# EAGLE design node_prototype (EAGLE 7.5.0)
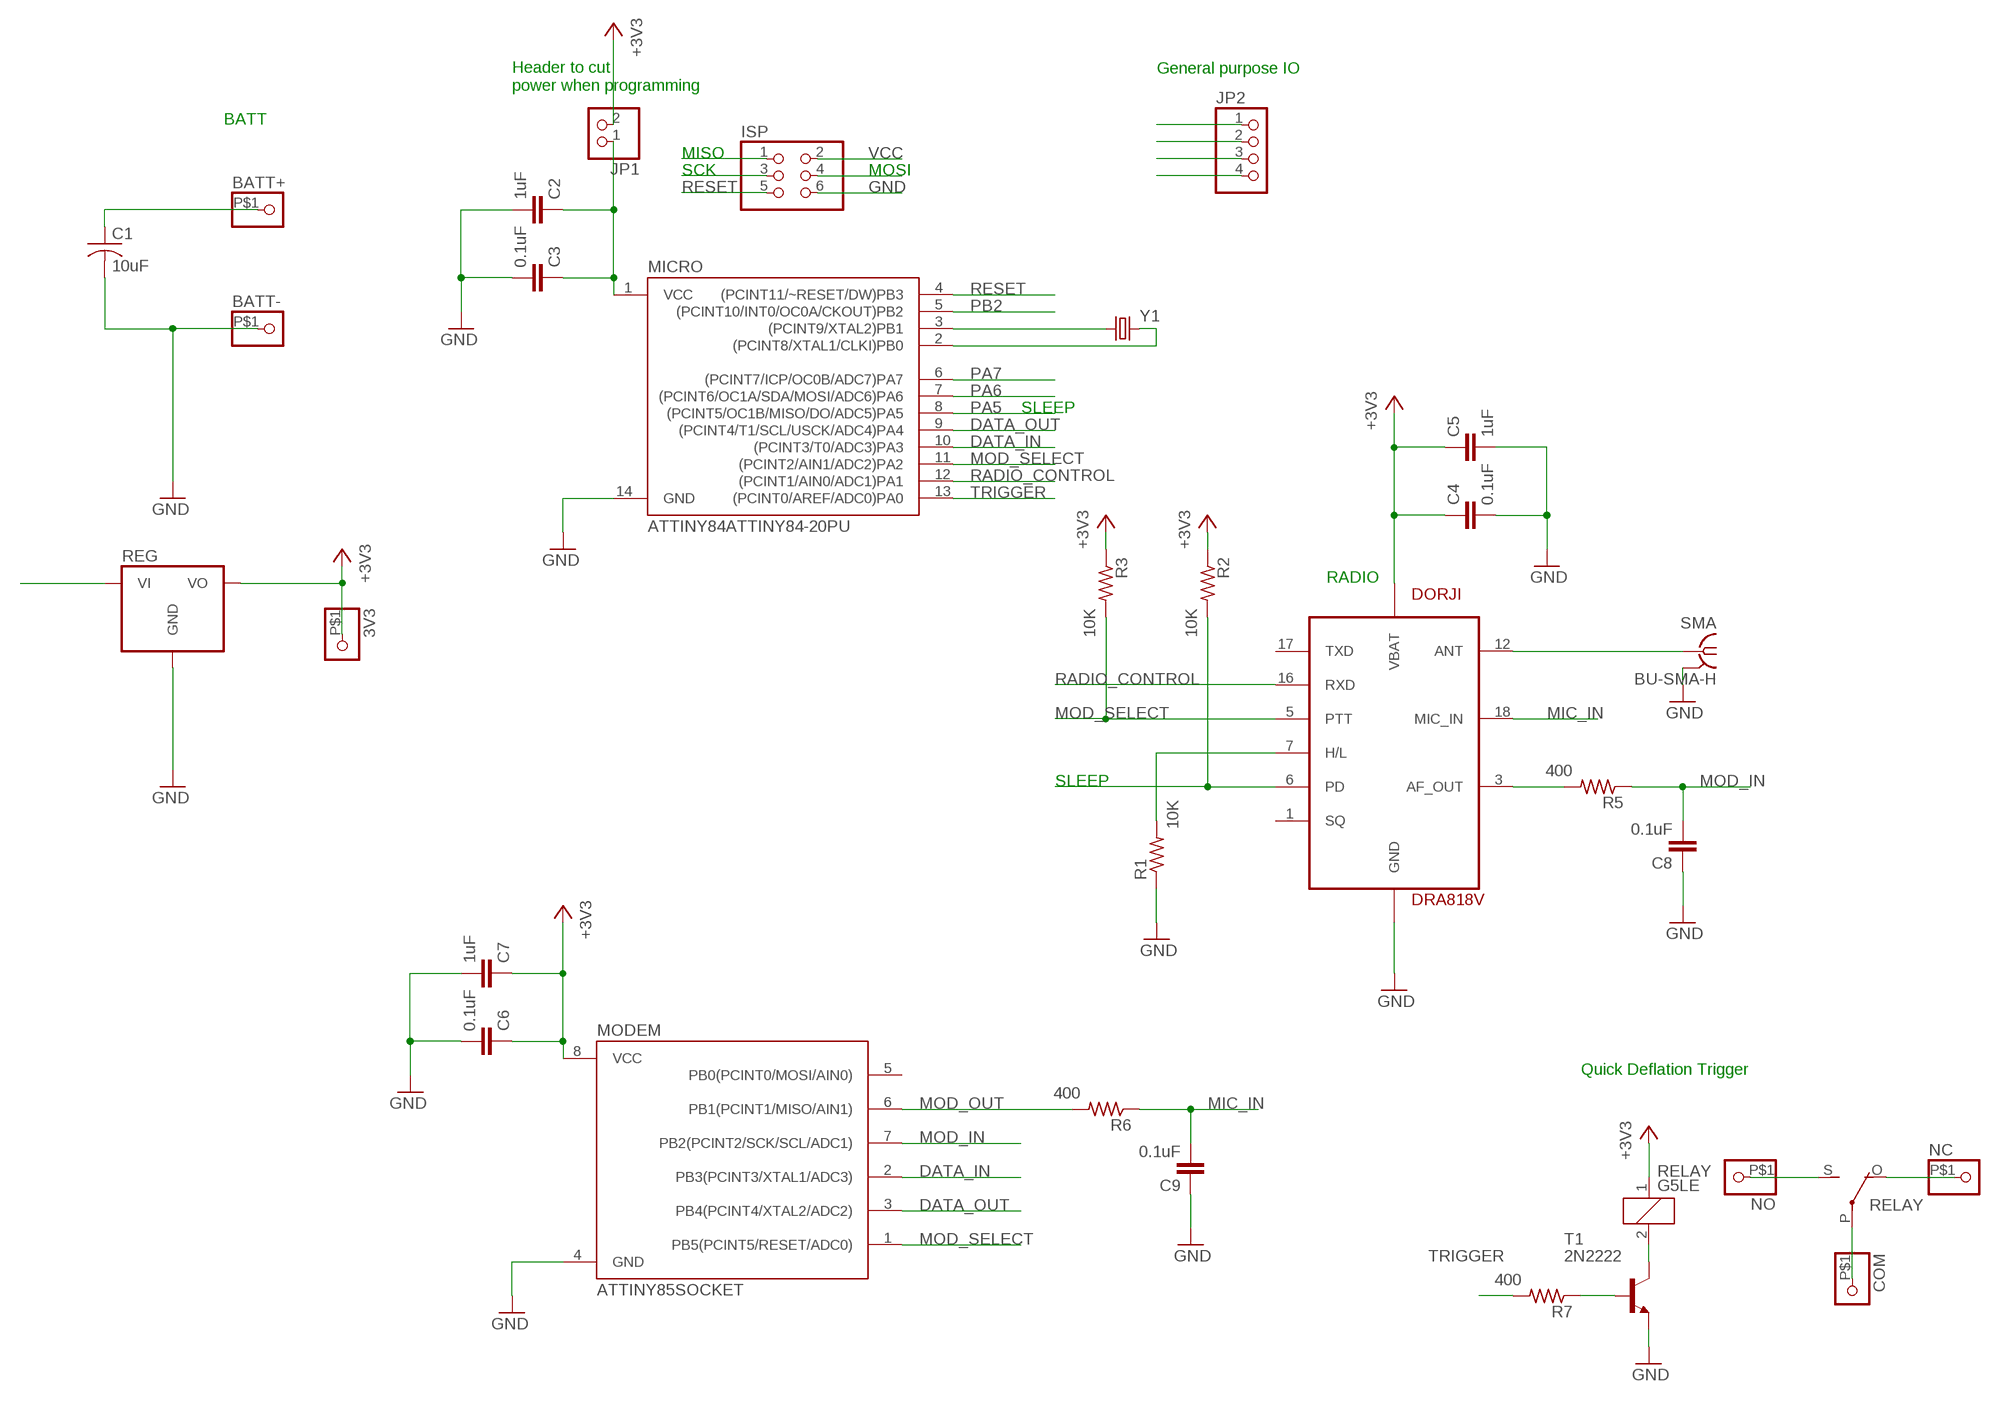
[diagram p0: schematic, sheet 1]

## Parts
3V3  PINHD-1X1  [1X01]
BATT+  PINHD-1X1  [1X01]
BATT-  PINHD-1X1  [1X01]
C1  10uF  C-US025-050X050  [C025-050X050]
C2  1uF  C-EUC0603  [C0603]
C3  0.1uF  C-EUC0603  [C0603]
C4  0.1uF  C-EUC0603  [C0603]
C5  1uF  C-EUC0603  [C0603]
C6  0.1uF  C-EUC0603  [C0603]
C7  1uF  C-EUC0603  [C0603]
C8  0.1uF  C-EUC0603  [C0603]
C9  0.1uF  C-EUC0603  [C0603]
COM  PINHD-1X1  [1X01]
DORJI  DRA818V  DORJIDRA818V  [DORJI]
ISP  PINHD-2X3  [2X03]
JP1  PINHD-1X2  [1X02]
JP2  PINHD-1X4  [1X04]
MICRO  ATTINY84ATTINY84-20PU  [DIL14]
MODEM  ATTINY85SOCKET  [SOCKET-08]
NC  PINHD-1X1  [1X01]
NO  PINHD-1X1  [1X01]
R1  10K  R-US_R0603  [R0603]
R2  10K  R-US_R0603  [R0603]
R3  10K  R-US_R0603  [R0603]
R5  400  R-US_R0603  [R0603]
R6  400  R-US_R0603  [R0603]
R7  400  R-US_R0603  [R0603]
REG  AP1117-3.3SOT223  [SOT223]
RELAY  G5LE  [G5LE]
SMA  BU-SMA-H  [BU-SMA-H]
T1  2N2222  [TO18]
Y1  CRYSTAL  [MYSMD2_RESONATOR]

## Nets
+3V3: 3V3.P$1 C4.1 C5.1 C6.1 C7.1 DORJI.8(VBAT) JP1.2 MODEM.8(VCC) R2.1 R3.1 REG.2(VO) REG.4(VO) RELAY.1
BATT: BATT+.P$1 C1.1 REG.3(VI)
DATA_IN: MICRO.10((PCINT3/T0/ADC3)PA3) MODEM.2(PB3(PCINT3/XTAL1/ADC3))
DATA_OUT: ISP.3 MICRO.9((PCINT4/T1/SCL/USCK/ADC4)PA4) MODEM.3(PB4(PCINT4/XTAL2/ADC2))
GND: BATT-.P$1 C1.2 C2.2 C3.2 C4.2 C5.2 C6.2 C7.2 C8.1 C9.1 DORJI.9(GND) DORJI.10(GND) ISP.6 MICRO.14(GND) MODEM.4(GND) R1.1 REG.1(GND) SMA.2 SMA.3 SMA.4 SMA.5 T1.1(E)
MIC_IN: C9.2 DORJI.18(MIC_IN) R6.1
MOD_IN: C8.2 MODEM.7(PB2(PCINT2/SCK/SCL/ADC1)) R5.1
MOD_OUT: MODEM.6(PB1(PCINT1/MISO/AIN1)) R6.2
MOD_SELECT: DORJI.5(PTT) MICRO.11((PCINT2/AIN1/ADC2)PA2) MODEM.1(PB5(PCINT5/RESET/ADC0)) R3.2
N$1: DORJI.12(ANT) SMA.1
N$2: DORJI.7(H/L) R1.2
N$4: DORJI.3(AF_OUT) R5.2
N$6: R7.1 T1.2(B)
N$7: RELAY.2 T1.3(C)
N$8: MICRO.3((PCINT9/XTAL2)PB1) Y1.1
N$9: NO.P$1 RELAY.S(2:S)
N$10: NC.P$1 RELAY.O(2:O)
N$11: COM.P$1 RELAY.P(2:P)
N$12: MICRO.2((PCINT8/XTAL1/CLKI)PB0) Y1.3
PA5: DORJI.6(PD) ISP.1 JP2.4 MICRO.8((PCINT5/OC1B/MISO/DO/ADC5)PA5) R2.2
PA6: ISP.4 JP2.3 MICRO.7((PCINT6/OC1A/SDA/MOSI/ADC6)PA6)
PA7: JP2.2 MICRO.6((PCINT7/ICP/OC0B/ADC7)PA7)
PB2: JP2.1 MICRO.5((PCINT10/INT0/OC0A/CKOUT)PB2)
RADIO_CONTROL: DORJI.16(RXD) MICRO.12((PCINT1/AIN0/ADC1)PA1)
RESET: ISP.5 MICRO.4((PCINT11/~RESET/DW)PB3)
TRIGGER: MICRO.13((PCINT0/AREF/ADC0)PA0) R7.2
VCC: C2.1 C3.1 ISP.2 JP1.1 MICRO.1(VCC)
Unconnected: DORJI.1(SQ) DORJI.17(TXD) MODEM.5(PB0(PCINT0/MOSI/AIN0))

## Notes on the sheet
- General purpose IO
- Header to cut
  power when programming
- BATT
- MISO
- SCK | MOSI
- SLEEP
- RADIO
- SLEEP
- Quick Deflation Trigger

## Library data of the parts
3V3 BATT+ BATT- COM NC NO = evan:PINHD-1X1: PIN HEADER
C1 = rcl:C-US: CAPACITOR, American symbol
C2-C9 = rcl:C-EU: CAPACITOR, European symbol
DORJI = dorji:DORJI: DRA818V 2-Meter transceiver modul
ISP = pinhead:PINHD-2X3: PIN HEADER
JP1 = pinhead:PINHD-1X2: PIN HEADER
JP2 = pinhead:PINHD-1X4: PIN HEADER
MICRO = evan:ATTINY84: Atmel 14-pin 2/4/8kB flash uC
MODEM = evan:ATTINY85: Atmel 14-pin 2/4/8kB flash uC
R1-R3 R5-R7 = rcl:R-US_: RESISTOR, American symbol
REG = evan:AP1117-3.3: http://www.digikey.com/product-detail/en/AP1117IE33G-13/AP1117IE33G-13DICT-ND/3677984 800mA and 1A Low Dropout (LDO) Positive Regulator 1.8V, 2.5V, 2.85V, 3.3V, 5V, and Adj
RELAY = relay:G5LE: RELAY 1 x switch, 10 A/120 V AC, 8 A/30 V DC, Omron; OC_FARNELL: unknown; OC_NEWARK: unknown
SMA = con-coax:BU-SMA-H: FEMALE SMA CONNECTOR Radiall; OC_FARNELL: unknown; OC_NEWARK: unknown
T1 = transistor:2N2222: NPN TRANSISTOR
Y1 = evan:CRYSTAL: CSTCE16M0V53-R0 Crystal

## Board
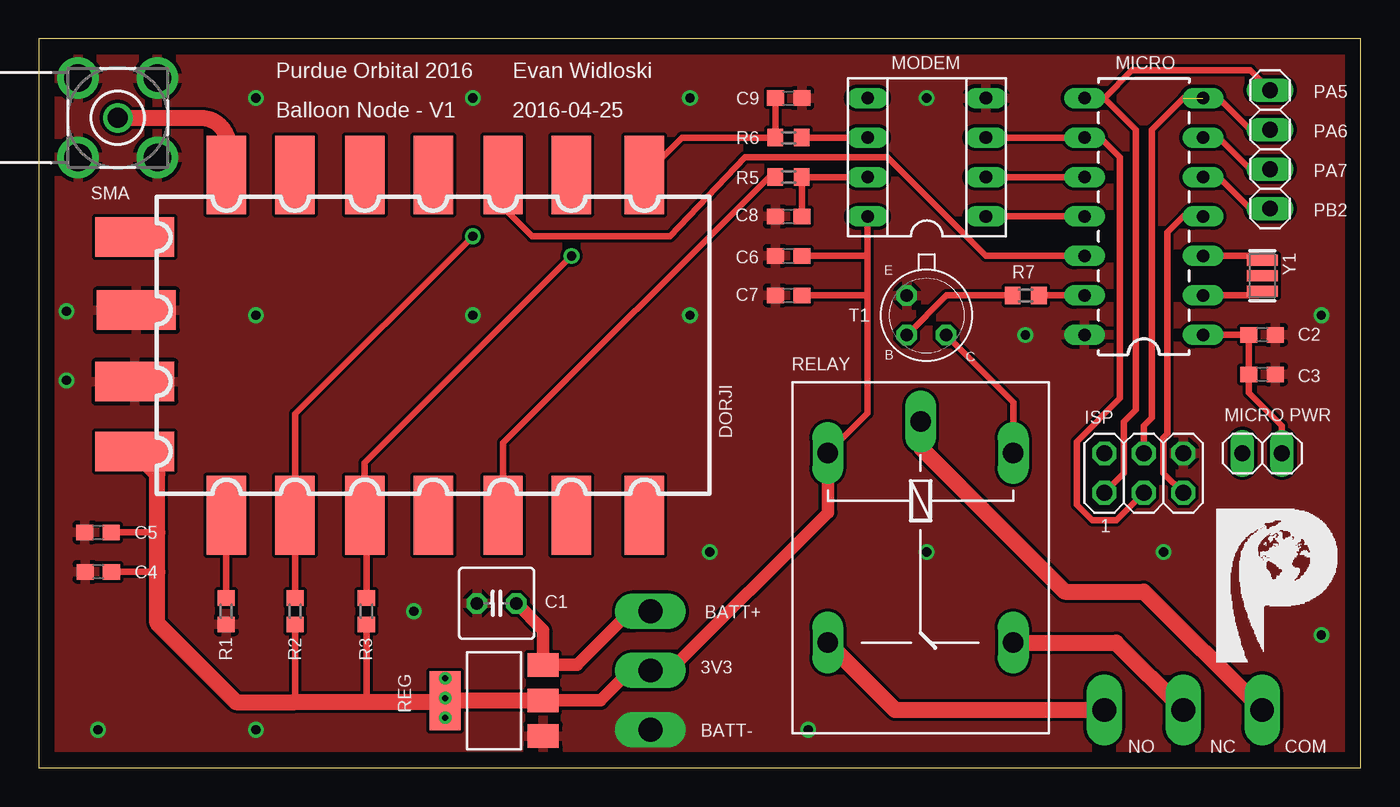
[diagram p1: board, top side]
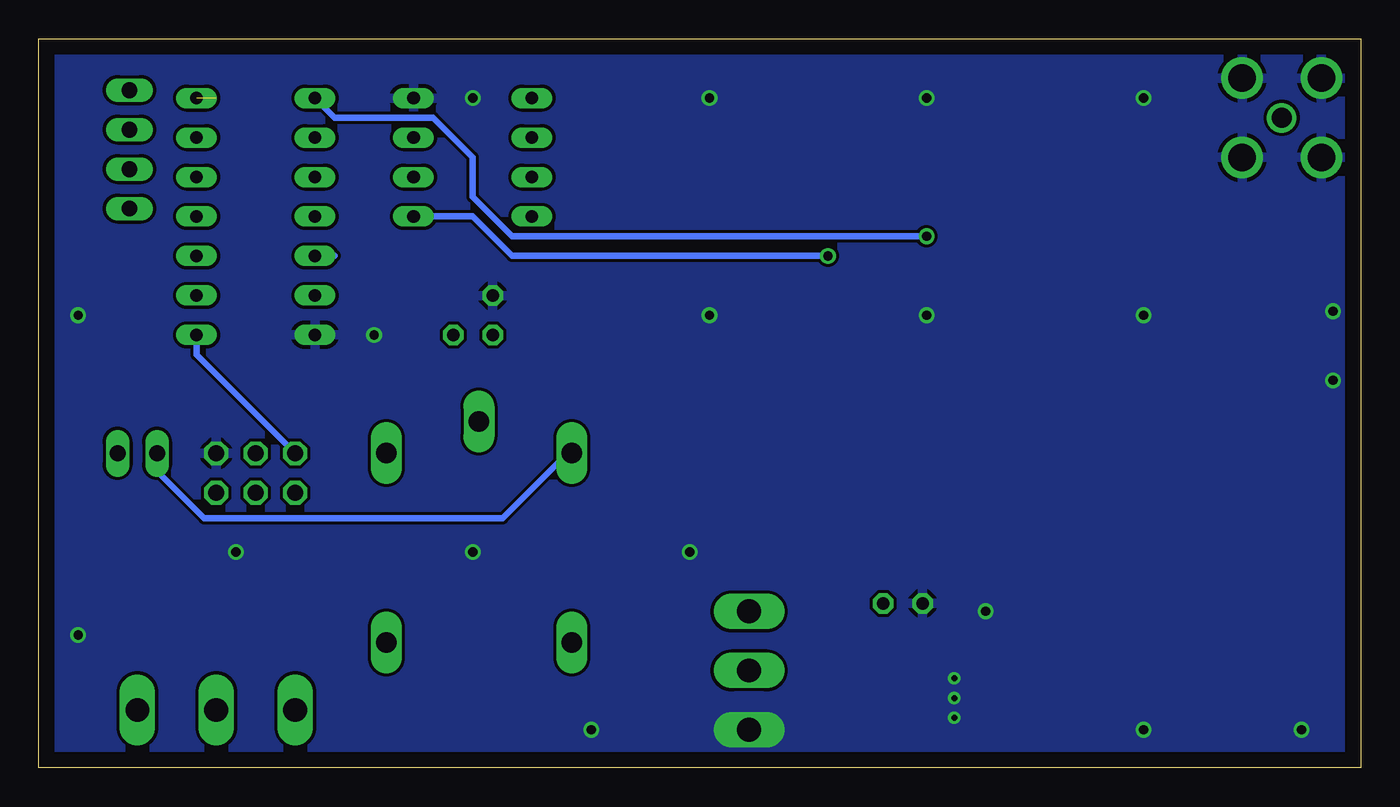
[diagram p2: board, bottom side, seen from below]

Size 85.08 x 46.91 mm. Coordinates in mm from the lower left corner, seen from the top.
Outline: 0,46.91 0,0 85.08,0 85.08,46.91 0,46.91
Copper layers (1*16): Top 0.035mm / dielectric 1.5mm / Bottom 0.035mm
Design rules "default": minimum track width 10mil, minimum drill 24mil, track to track 8mil, track to pad 8mil, pad to pad 8mil, via to via 8mil, smd to smd 8mil, copper to edge 40mil, drill to drill 8mil, minimum pad ring 10mil, minimum via ring 8mil, stop-mask expansion 4mil, vias tented up to drill 0mil, thermal gap 10mil

### Footprints (pad centres in the part's own frame; a part is rotated, then mirrored left to right if it is on the bottom)
1X01 = drill 1.524 pad 1.676 long: P$1 0,0
C025-050X050 = drill 0.813 octagon: 1 -1.27,0; 2 1.27,0
C0603 = smd 1.1 x 1: 1 -0.85,0; 2 0.85,0
DORJI = smd 2.54 x 5.08: 1 4.2,20.5; 2 8.9,20.5; 3 13.3,20.5; 4 17.8,20.5; 5 22.2,20.5; 6 26.7,20.5; 7 31.1,20.5; 12 31.1,-1.4; 13 26.7,-1.4; 14 22.2,-1.4; 15 17.8,-1.4; 16 13.3,-1.4; 17 8.9,-1.4; 18 4.2,-1.4 | smd 5.08 x 2.54: 8 37,16.4; 9 37,11.9; 10 36.9,7.3; 11 37,2.6
2X03 = drill 1.016 octagon: 1 -2.54,-1.27; 2 -2.54,1.27; 3 0,-1.27; 4 0,1.27; 5 2.54,-1.27; 6 2.54,1.27
1X02 = drill 1.016 long: 1 -1.27,0; 2 1.27,0
1X04 = drill 1.016 long: 1 -3.81,0; 2 -1.27,0; 3 1.27,0; 4 3.81,0
DIL14 = drill 0.813 long: 1 -8.89,-3.81; 2 -6.35,-3.81; 3 -3.81,-3.81; 4 -1.27,-3.81; 5 1.27,-3.81; 6 3.81,-3.81; 7 6.35,-3.81; 8 6.35,3.81; 9 3.81,3.81; 10 1.27,3.81; 11 -1.27,3.81; 12 -3.81,3.81; 13 -6.35,3.81; 14 -8.89,3.81
SOCKET-08 = drill 0.813 long: 1 -3.81,-3.81; 2 -1.27,-3.81; 3 1.27,-3.81; 4 3.81,-3.81; 5 3.81,3.81; 6 1.27,3.81; 7 -1.27,3.81; 8 -3.81,3.81
R0603 = smd 1 x 1.1: 1 -0.85,0; 2 0.85,0
SOT223 = smd 1.499 x 2.007: 1 -2.261,-3.15; 2 0.025,-3.15; 3 2.311,-3.15 | smd 3.81 x 2.007: 4 0,3.15
G5LE = drill 1.321 long: 1 -7.493,-5.969; 2 -7.493,5.969; O 4.699,5.969; P -9.525,0; S 4.699,-5.969
BU-SMA-H = drill 1.27: 1 0,0 | drill 1.778: 2 -2.55,2.55; 3 2.55,2.55; 4 2.55,-2.55; 5 -2.55,-2.55
TO18 = drill 0.813 octagon: 1 -1.27,-1.27; 2 1.27,-1.27; 3 1.27,1.27
MYSMD2_RESONATOR = smd 0.7 x 2: 1 -1,0; 2 0,0; 3 1,0

### Placement (x,y rotation side)
3V3  39.37,6.27 0 top
BATT+  39.37,10.08 180 top
BATT-  39.37,2.46 180 top
C1  29.46,10.59 180 top
C2  78.74,27.86 0 top
C3  78.74,25.32 0 top
C4  3.82,12.62 180 top
C5  3.81,15.16 180 top
C6  48.26,32.94 180 top
C7  48.26,30.4 180 top
C8  48.26,35.48 0 top
C9  48.26,43.1 180 top
COM  78.74,3.73 270 top
DORJI  43.18,36.75 180 top
ISP  71.12,18.97 0 top
JP1  78.74,20.24 180 top
JP2  79.25,39.8 90 top
MICRO  71.12,36.75 90 top
MODEM  57.15,39.29 90 top
NC  73.66,3.73 270 top
NO  68.58,3.73 270 top
R1  12.06,10.08 90 top
R2  16.51,10.08 90 top
R3  21.08,10.08 90 top
R5  48.26,38.02 180 top
R6  48.26,40.56 0 top
R7  63.52,30.4 0 top
REG  29.3,4.32 90 top
RELAY  56.75,12.76 270 top
SMA  5.08,41.83 180 top
T1  57.14,29.12 270 top
Y1  78.74,31.67 270 top

### Tracks (layer width: path | path; a pad name or v marks a point on that pad's centre or on a via)
+3V3
  Top 0.406: DORJI.8 7.34,20.24 | C5.1 7.62,15.16 | C4.1 7.62,12.62 | R2.1 16.51,4.24 | R3.1 21.08,4.24 | 53.34,30.4 53.34,32.94 | 53.34,32.94 MODEM.8 | C6.1 53.34,32.94 | C7.1 53.34,30.4 | 50.8,20.27 53.34,22.81 53.34,30.4
  Top 0.61: 7.62,20.18 DORJI.8 | RELAY.1 50.8,20.27
  Top 0.813: RELAY.1 50.8,20.24 50.8,16.43 40.64,6.27 3V3.P$1 38.1,6.27 36.17,4.34 REG.2
  Top 1.016: 6.35,20.18 DORJI.8 7.62,18.91 7.62,15.16 7.62,12.62 7.62,9.32 12.7,4.24 16.51,4.24 21.08,4.24 26.07,4.24 REG.4 26.18,4.34 REG.2
  Bottom 0.406: RELAY.1 51.04,20.26 55.24,16.05 74.42,16.05 77.47,19.1 JP1.2
BATT
  Top 0.813: C1.1 32.45,8.88 REG.3 34.65,6.63 38.1,10.08 BATT+.P$1
DATA_IN
  Top 0.406: MODEM.2 MICRO.10
DATA_OUT
  Top 0.406: MODEM.3 MICRO.9 68.33,40.56 69.6,39.29 69.6,23.8 66.8,21.01 66.8,16.94 67.82,15.93 69.34,15.93 ISP.3
GND  (via drill 0.38 pad 0.3, 0.6)
  other vias: 13.97,43.1 27.94,43.1 41.91,43.1 57.15,43.1 63.5,27.86 41.91,29.13 27.94,29.13 13.97,29.13 43.18,13.89 57.15,13.89 72.39,13.89 49.53,2.46 3.81,2.46 1.78,29.39 1.78,24.94 24.13,10.08 13.97,2.46 82.55,29.13 82.55,8.56 26.16,5.77 26.16,4.5 26.16,3.23
  pour Bottom: 0,46.91 85.09,46.91 85.09,-0.08 0,-0.08
  pour Top: 0,46.91 85.09,46.91 85.09,-0.08 0,-0.08
MIC_IN
  Top 0.406: C9.2 R6.1 41.39,40.56 DORJI.18
MOD_IN
  Top 0.406: C8.2 R5.1 MODEM.7
MOD_OUT
  Top 0.406: MODEM.6 R6.2
MOD_SELECT  (via drill 0.6)
  Top 0.406: R3.2 21.08,15.59 DORJI.5 20.98,19.63 v34.29,32.94 | MODEM.1 MICRO.11
  Bottom 0.406: 59.69,35.48 MODEM.1 57.15,35.48 54.61,32.94 v34.29,32.94
N$1
  Top 1.016: SMA.1 10.41,41.83 arc-90 12.19,40.06 12.19,38.27 arc-90 DORJI.12
N$2
  Top 0.406: R1.2 12.06,15.13 DORJI.7
N$4
  Top 0.406: DORJI.3 29.88,20.91 46.99,38.02 R5.2
N$6
  Top 0.406: T1.2 58.42,30.4 R7.1
N$7
  Top 0.406: T1.3 62.72,23.54 RELAY.2
N$8
  Top 0.406: Y1.1 78.47,32.94 MICRO.3
N$9
  Top 1.016: RELAY.S 55.12,3.73 NO.P$1
N$10
  Top 1.016: RELAY.O 69.33,8.06 NC.P$1
N$11
  Top 1.016: COM.P$1 71.12,11.35 66.04,11.35 56.75,20.64 RELAY.P
N$12
  Top 0.406: Y1.3 78.47,30.4 MICRO.2
PA5  (via drill 0.6)
  Top 0.406: ISP.1 69.85,18.97 69.85,22.28 70.61,23.04 70.61,41.07 68.58,43.1 | MICRO.8 68.58,43.1 | JP2.4 77.98,44.88 70.36,44.88 68.58,43.1 | R2.2 16.51,16.22 16.51,22.78 v27.94,34.21
  Top 0.61: 16.51,16.22 DORJI.6
  Bottom 0.406: MICRO.8 66.04,41.83 59.69,41.83 57.15,39.29 57.15,36.75 54.61,34.21 v27.94,34.21
PA6  (1 unrouted)
  Top 0.406: ISP.4 71.12,22.02 71.63,22.53 71.63,41.07 73.66,43.1 | MICRO.7 75.95,43.1 77.98,41.07 JP2.3
PA7
  Top 0.406: MICRO.6 75.95,40.56 77.98,38.53 JP2.2
PB2
  Top 0.406: MICRO.5 75.95,38.02 77.98,35.99 JP2.1
RADIO_CONTROL
  Top 0.406: DORJI.16 29.88,36.08 31.75,34.21 40.64,34.21 45.47,39.29 54.61,39.29 60.96,32.94 MICRO.12
  Bottom 0.406: 66.04,32.94 MICRO.12
RESET
  Top 0.406: ISP.5 72.39,18.97 72.39,21.26 72.64,21.51 72.64,34.47 73.66,35.48 MICRO.4
TRIGGER
  Top 0.406: R7.2 MICRO.13
VCC
  Top 0.406: MICRO.1 C2.1 C3.1 77.89,24.14 80.01,22.02 JP1.1
  Bottom 0.406: ISP.2 74.93,26.59 MICRO.1

### Text on the board
_tsilk: Purdue Orbital 2016 | Evan Widloski | PA5 | Balloon Node - V1 | 2016-04-25 | PA6 | PA7 | PB2 | E | B | C | MICRO PWR | 1